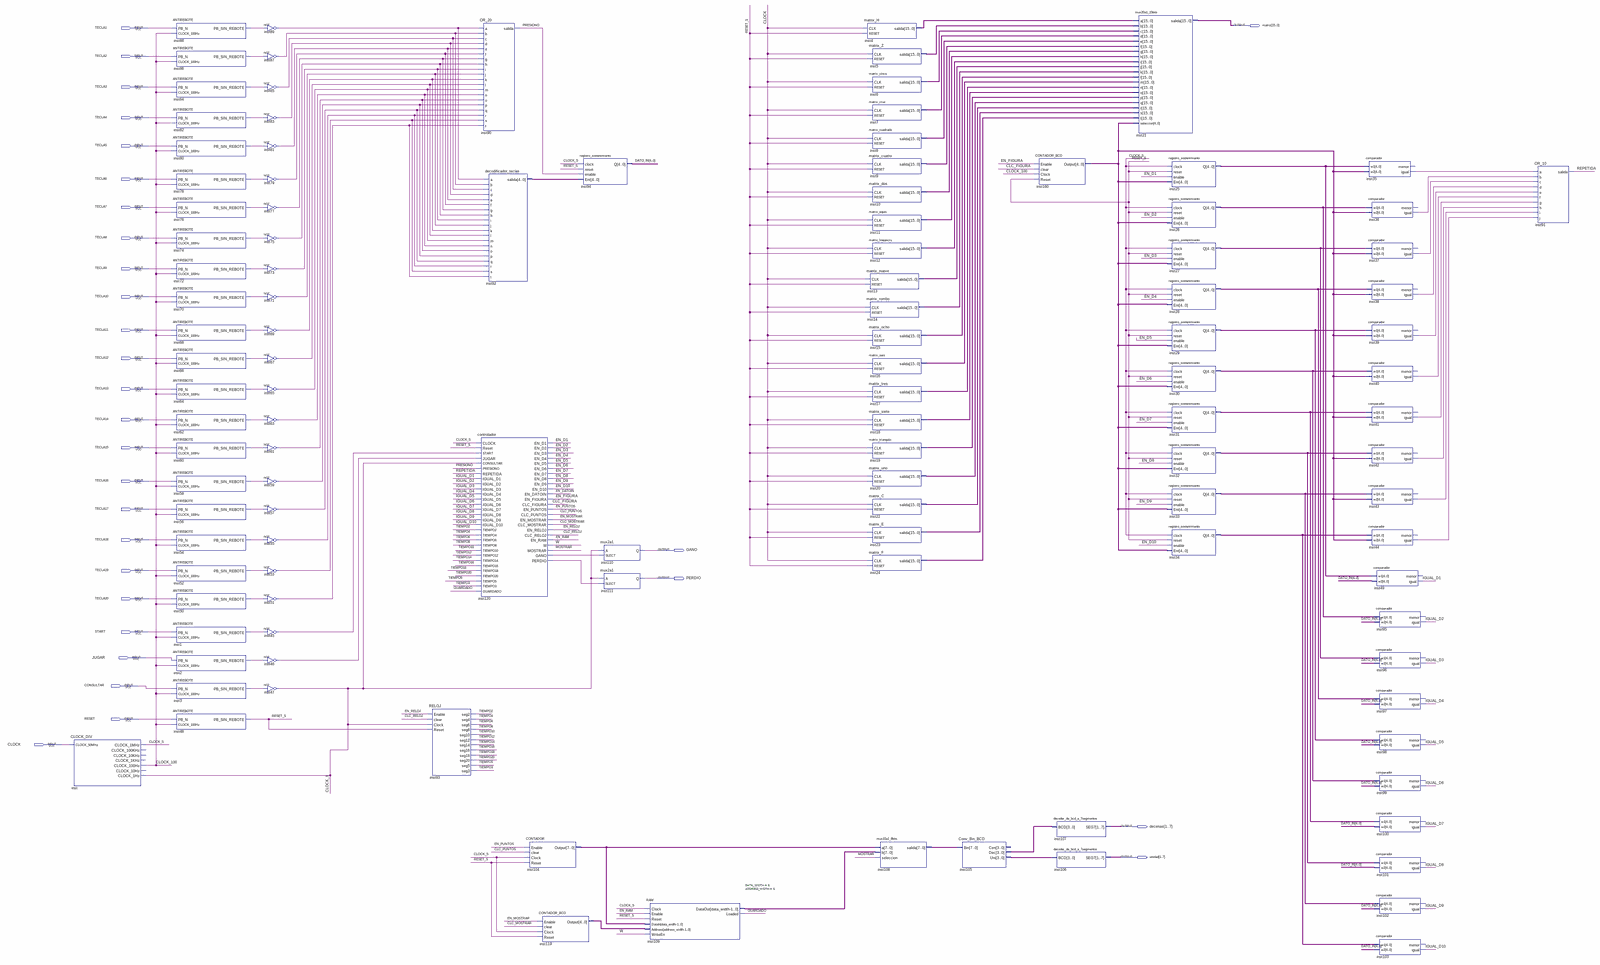
[diagram p0: schematic sheet, whole]
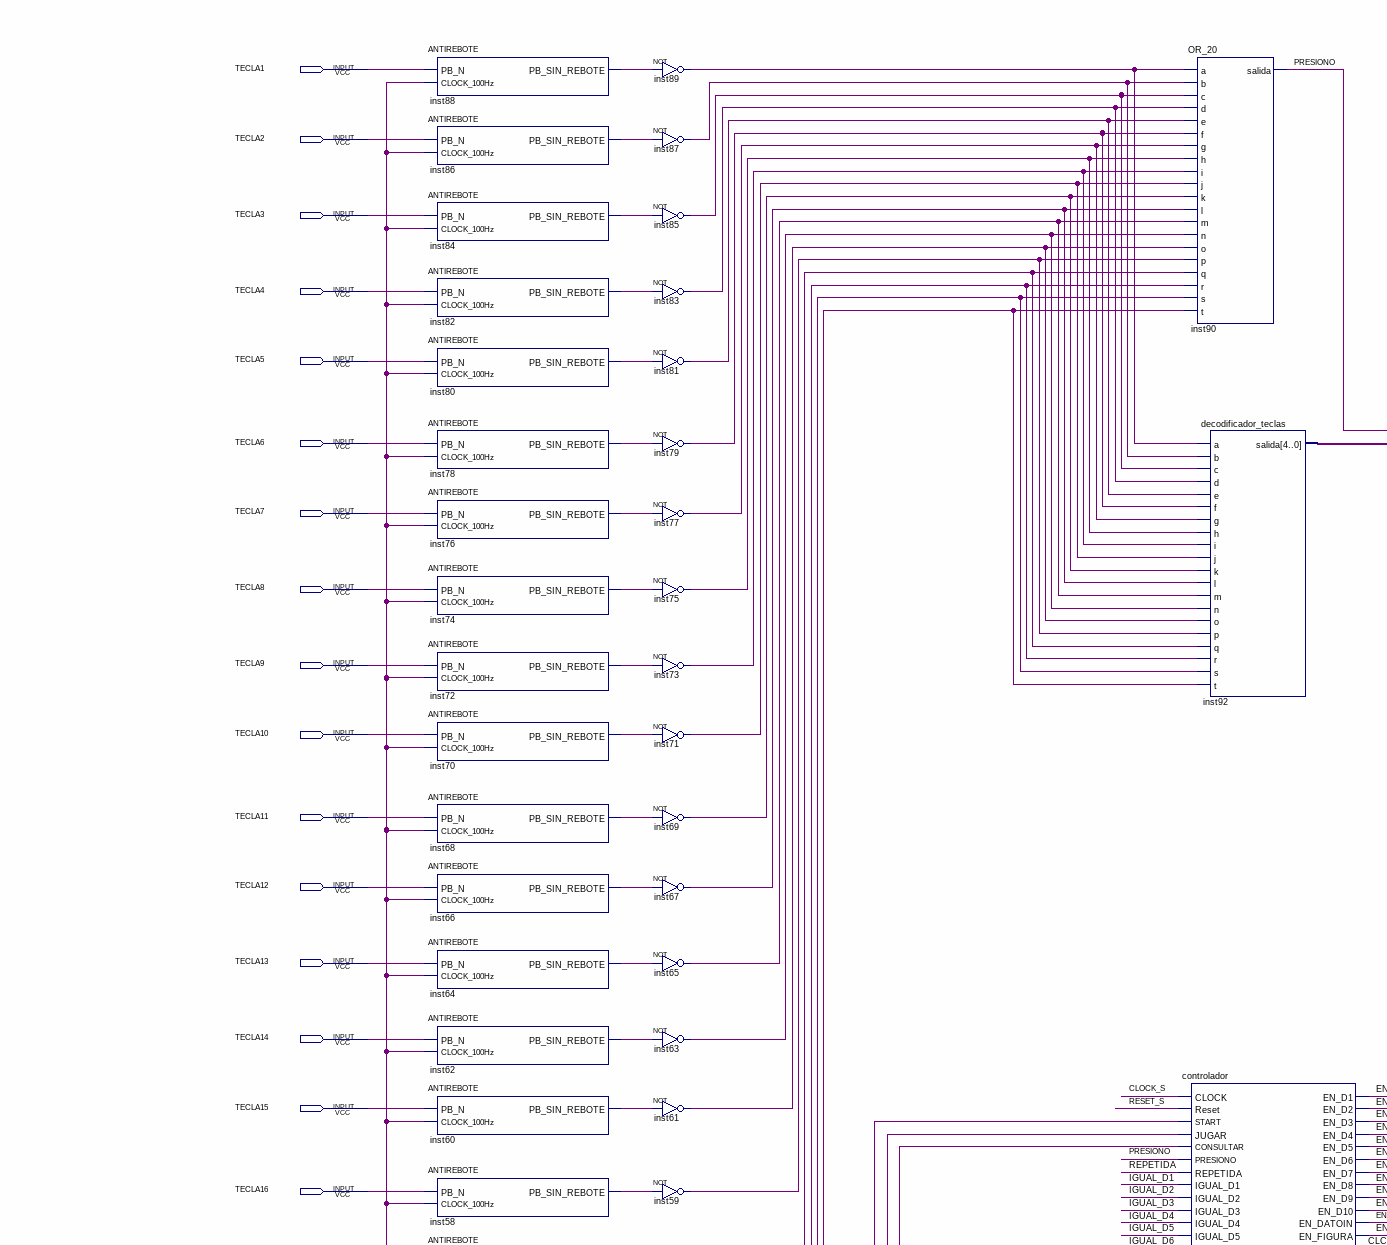
[diagram p1: schematic sheet, upper left part]
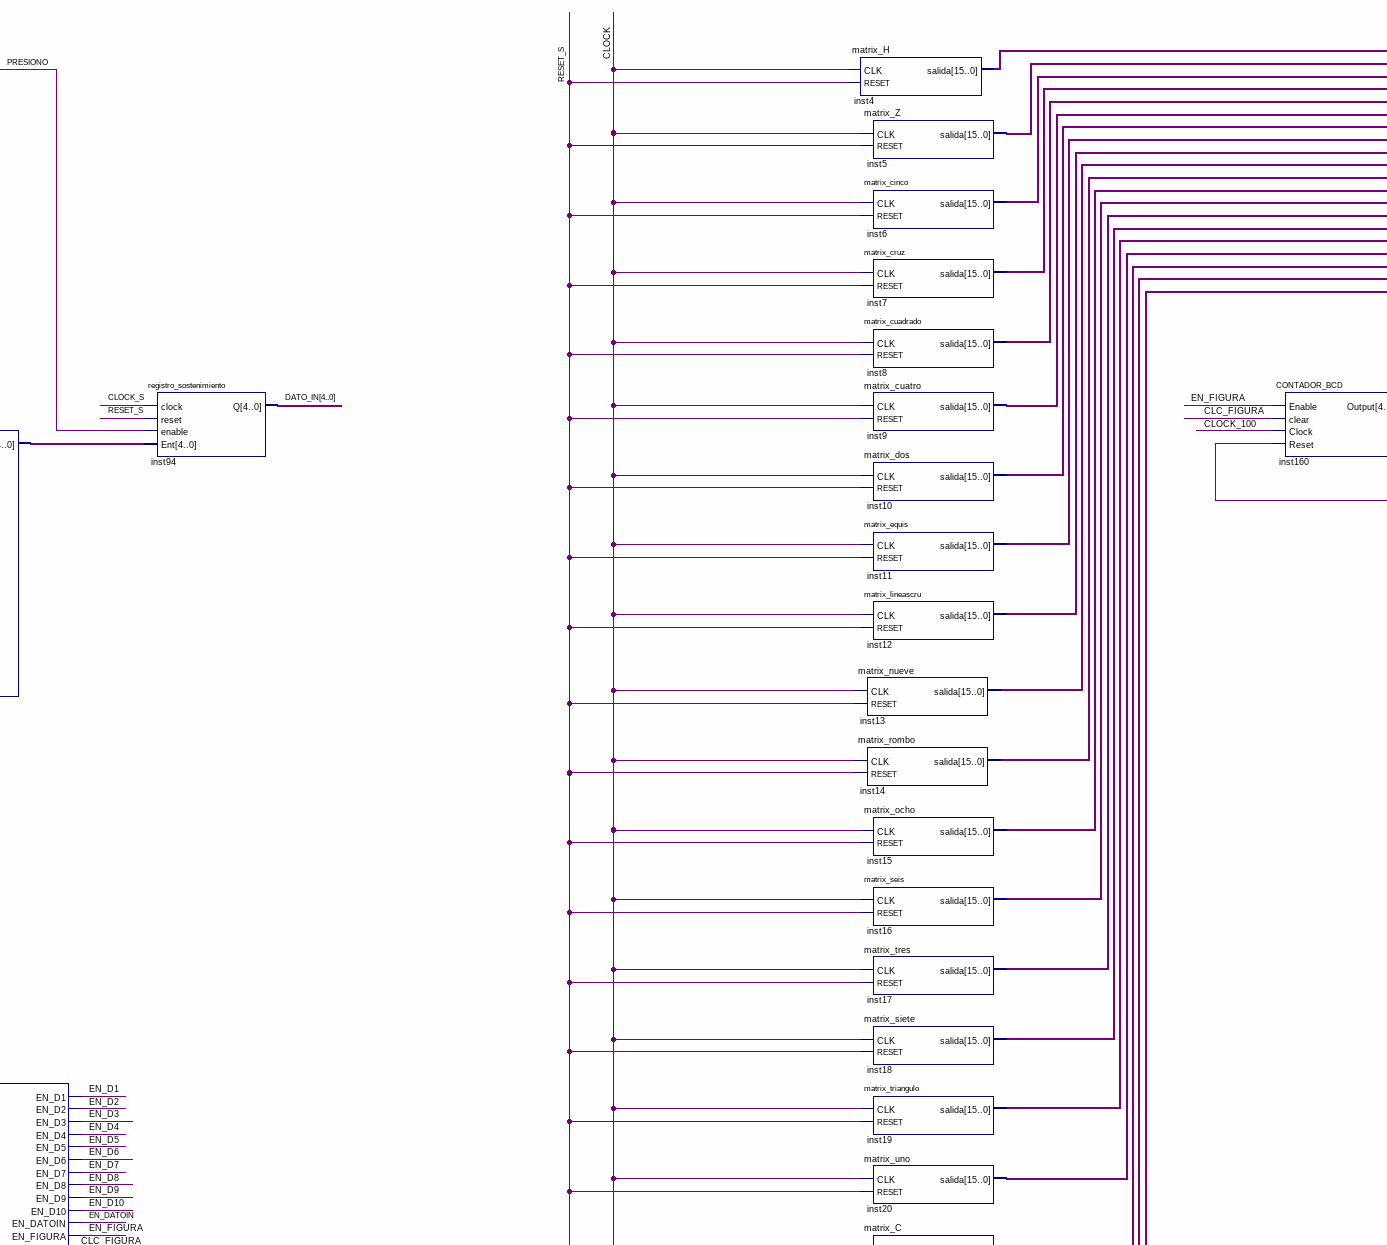
[diagram p2: schematic sheet, upper centre part]
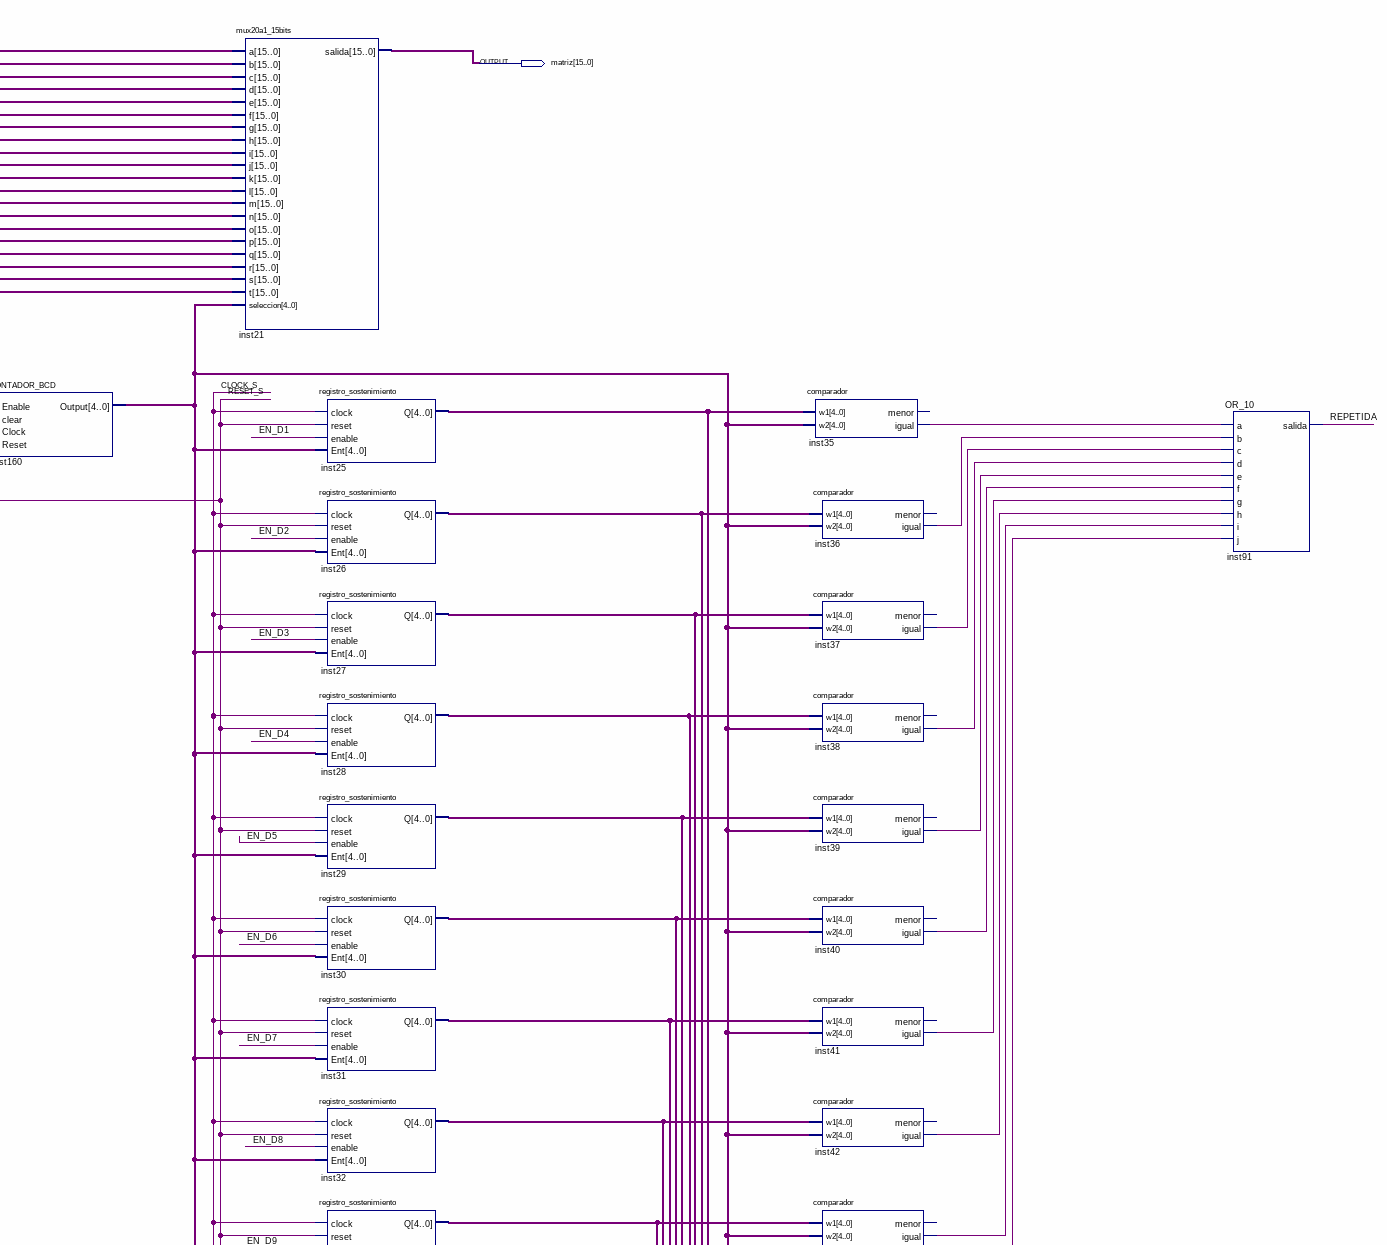
[diagram p3: schematic sheet, upper right part]
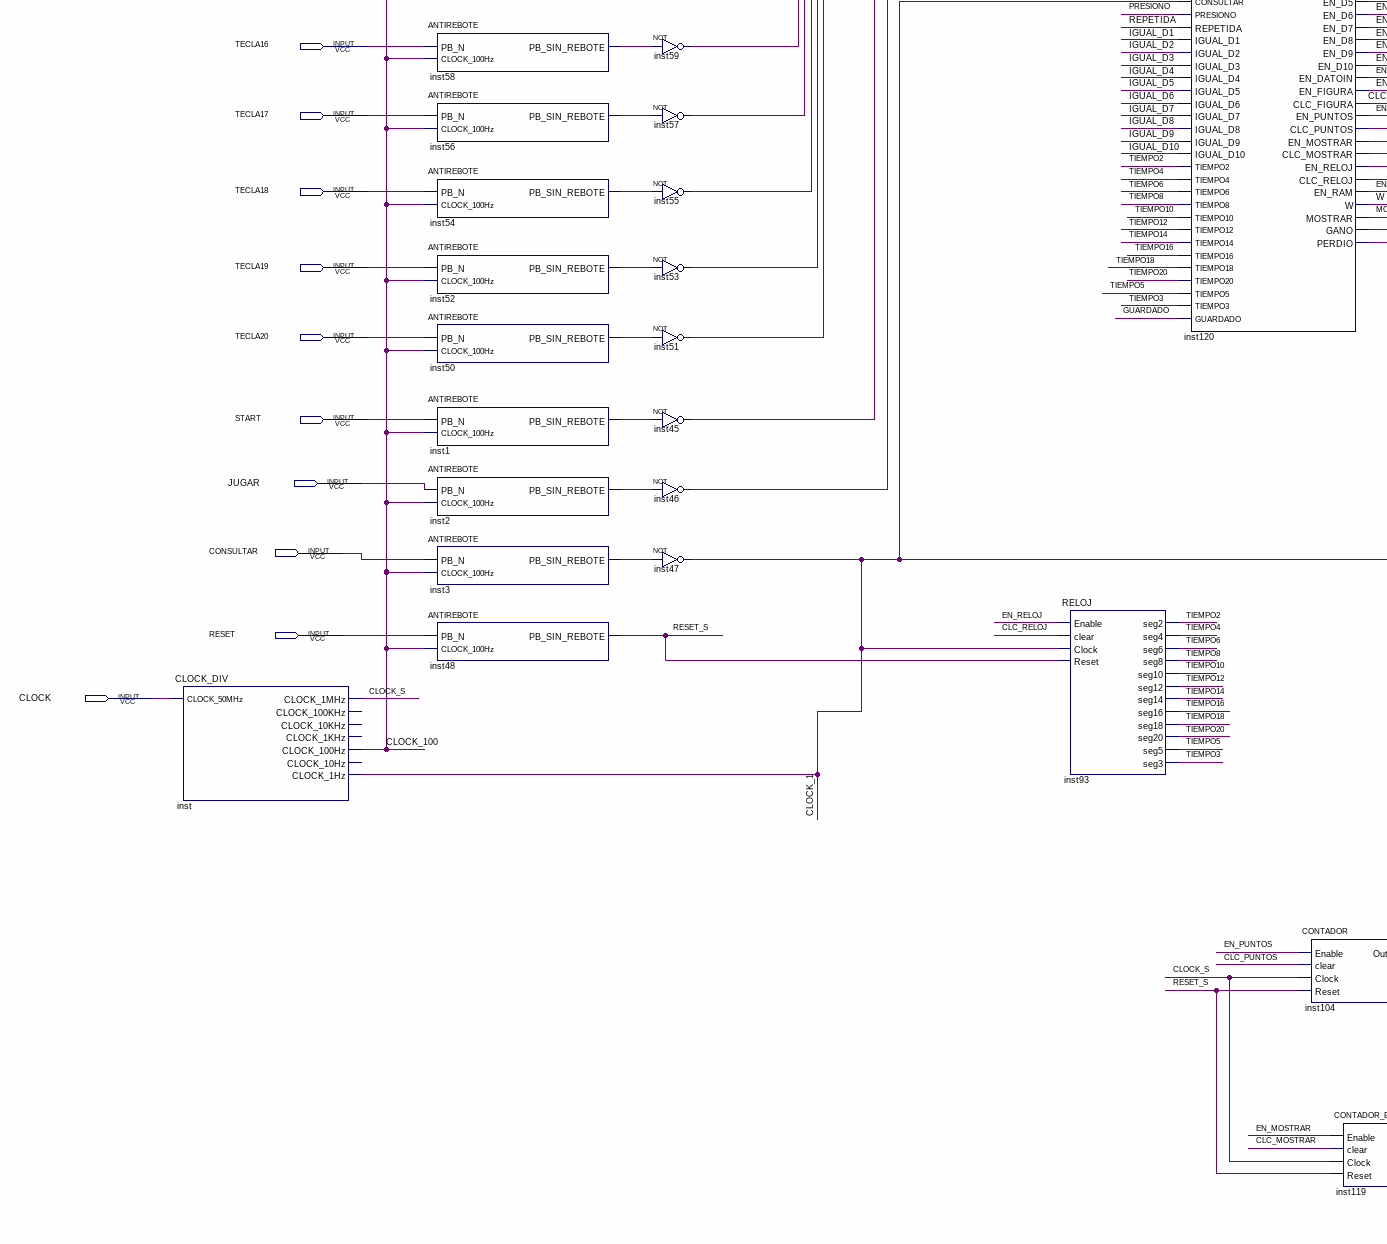
[diagram p4: schematic sheet, lower left part]
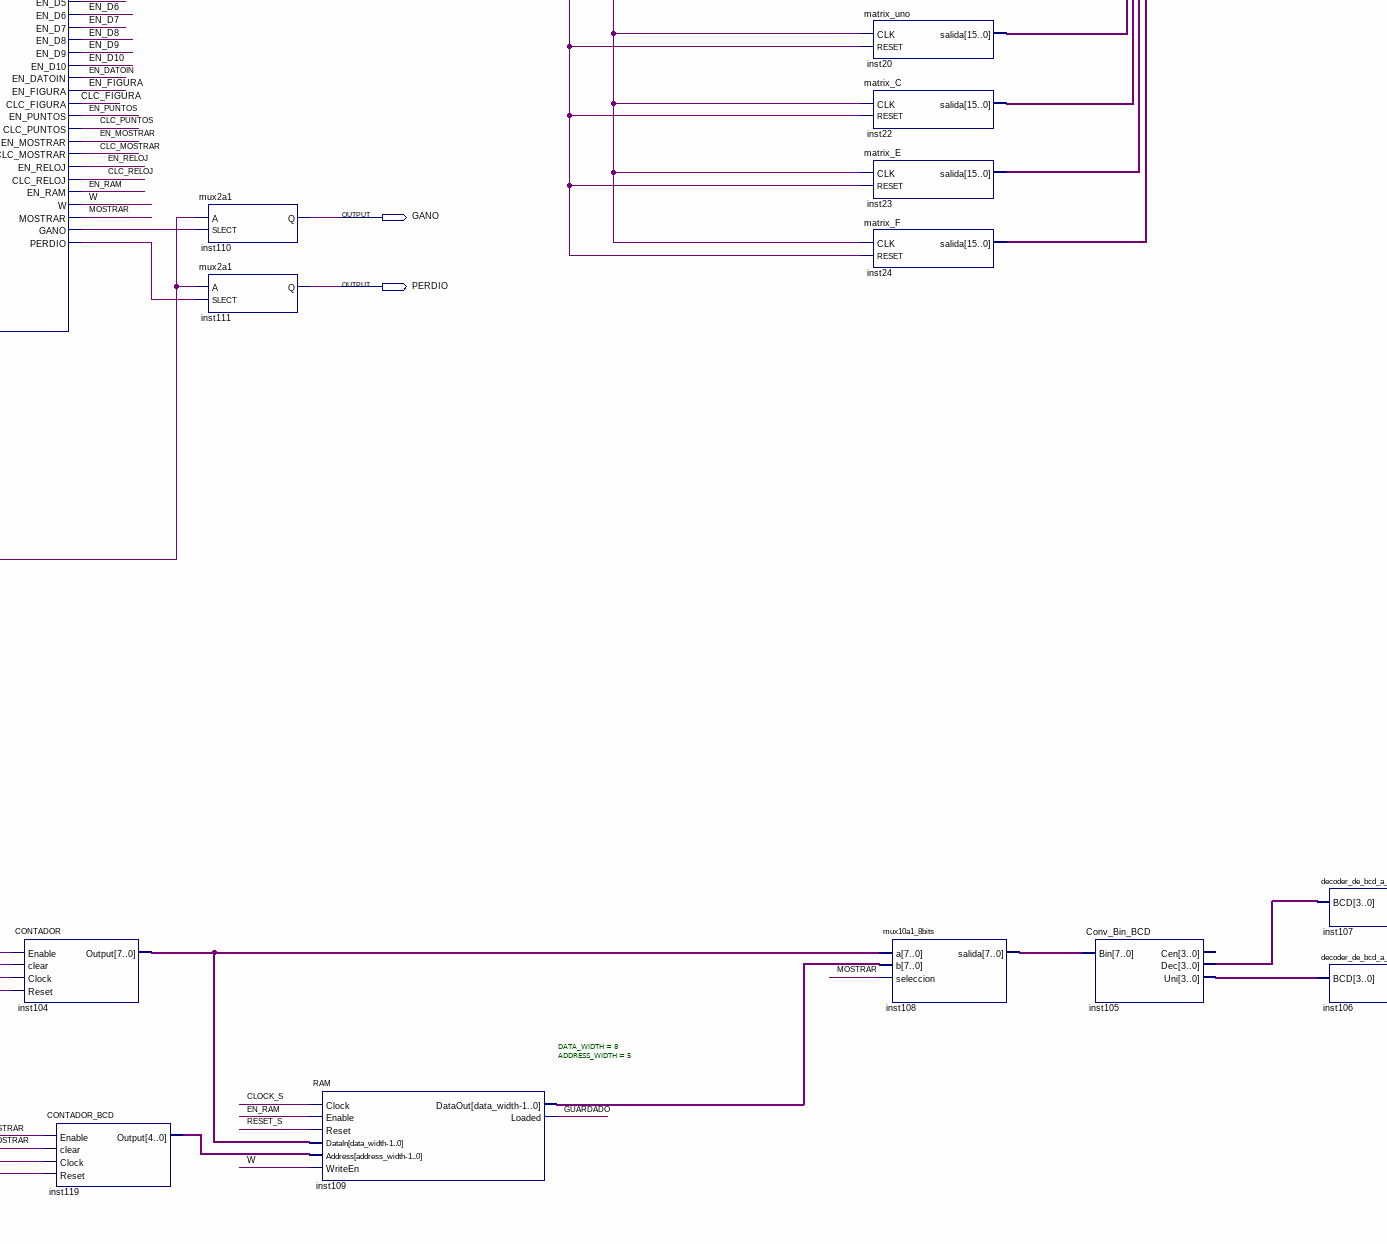
[diagram p5: schematic sheet, lower centre part]
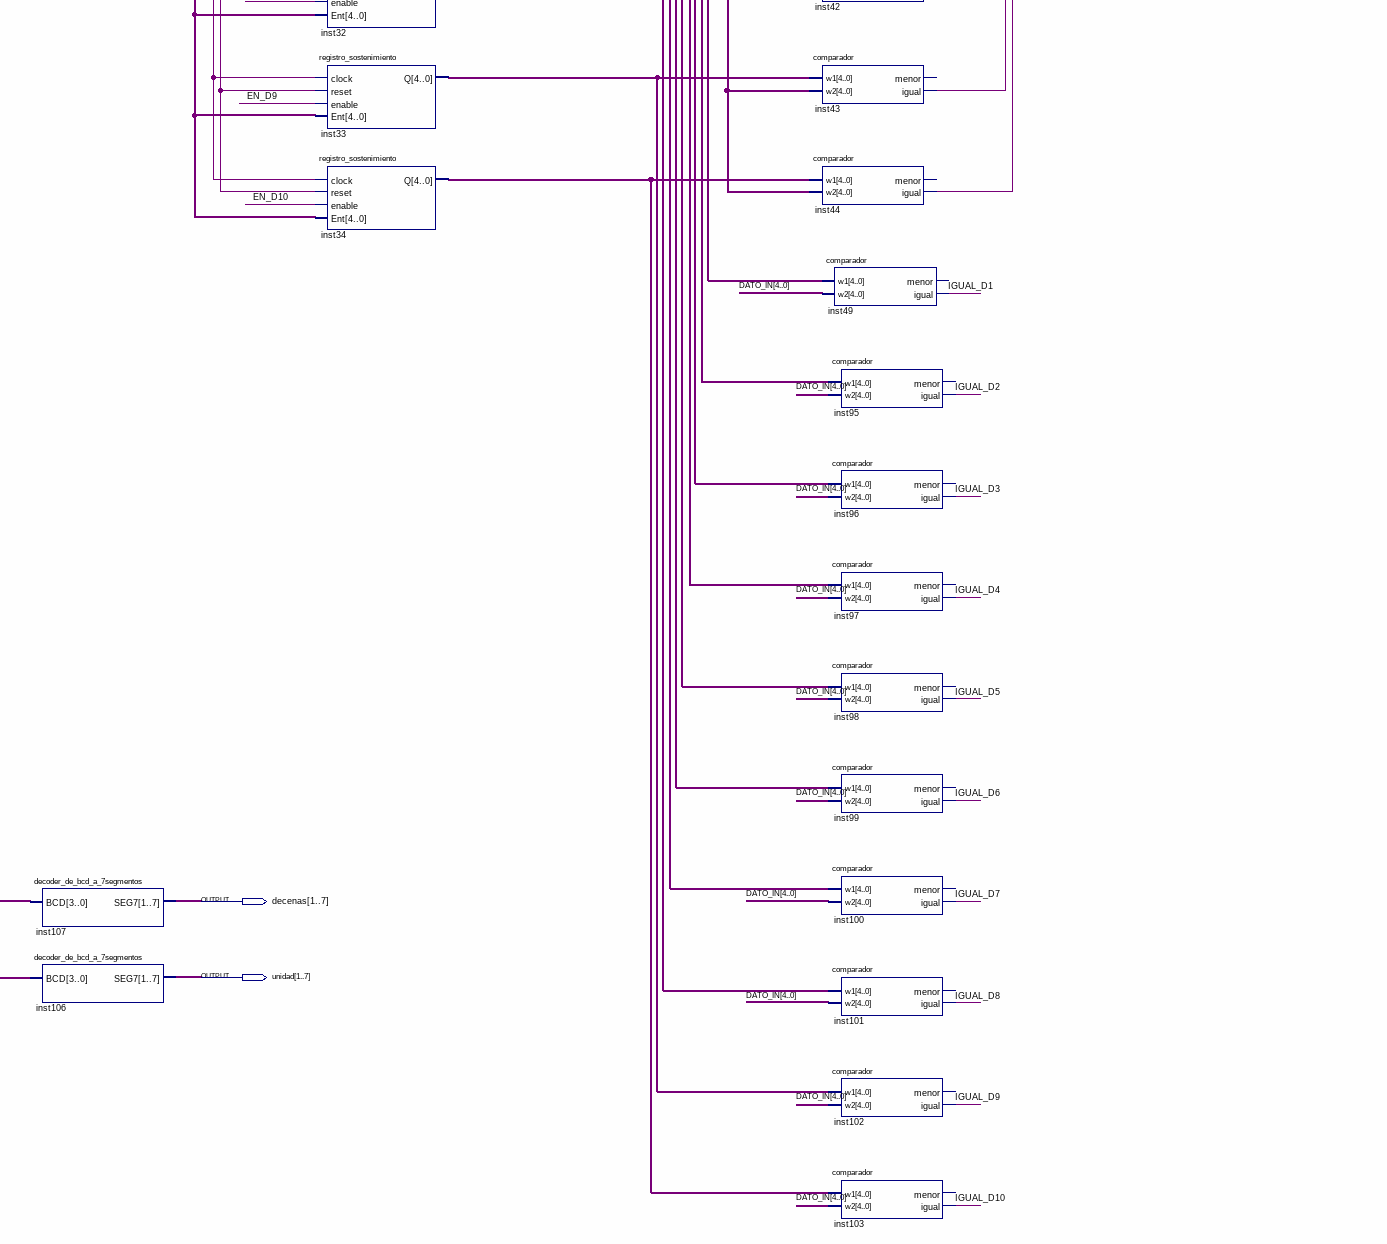
[diagram p6: schematic sheet, lower right part]
// Quartus schematic juego_de_memoria.bdf as structural Verilog: 115 symbols, 30 pins
module juego_de_memoria (
  input  TECLA1,
  input  TECLA2,
  input  TECLA3,
  input  TECLA4,
  input  TECLA5,
  input  TECLA6,
  input  TECLA7,
  input  TECLA8,
  input  TECLA9,
  input  TECLA10,
  input  TECLA11,
  input  TECLA12,
  input  TECLA13,
  input  TECLA14,
  input  TECLA15,
  input  TECLA16,
  input  TECLA17,
  input  TECLA18,
  input  TECLA19,
  input  TECLA20,
  input  START,
  input  JUGAR,
  input  CONSULTAR,
  input  RESET,
  input  CLOCK,
  output [15:0] matriz,
  output GANO,
  output PERDIO,
  output [1:7] decenas,
  output [1:7] unidad
);

  wire CLC_FIGURA, CLC_MOSTRAR, CLC_PUNTOS, CLC_RELOJ, CLOCK_1, CLOCK_100, CLOCK_S, EN_D1, EN_D2, EN_D3,
       EN_D4, EN_D5, EN_D6, EN_D7, EN_D8, EN_D9, EN_D10, EN_DATOIN, EN_FIGURA, EN_MOSTRAR, EN_PUNTOS, EN_RAM,
       EN_RELOJ, GUARDADO, IGUAL_D1, IGUAL_D2, IGUAL_D3, IGUAL_D4, IGUAL_D5, IGUAL_D6, IGUAL_D7, IGUAL_D8,
       IGUAL_D9, IGUAL_D10, inst1_pb_sin_rebote, inst2_pb_sin_rebote, inst3_pb_sin_rebote, inst35_igual,
       inst36_igual, inst37_igual, inst38_igual, inst39_igual, inst40_igual, inst41_igual, inst42_igual,
       inst43_igual, inst44_igual, inst45_out, inst46_out, inst50_pb_sin_rebote, inst51_out,
       inst52_pb_sin_rebote, inst53_out, inst54_pb_sin_rebote, inst55_out, inst56_pb_sin_rebote, inst57_out,
       inst58_pb_sin_rebote, inst59_out, inst60_pb_sin_rebote, inst61_out, inst62_pb_sin_rebote, inst63_out,
       inst64_pb_sin_rebote, inst65_out, inst66_pb_sin_rebote, inst67_out, inst68_pb_sin_rebote, inst69_out,
       inst70_pb_sin_rebote, inst71_out, inst72_pb_sin_rebote, inst73_out, inst74_pb_sin_rebote, inst75_out,
       inst76_pb_sin_rebote, inst77_out, inst78_pb_sin_rebote, inst79_out, inst80_pb_sin_rebote, inst81_out,
       inst82_pb_sin_rebote, inst83_out, inst84_pb_sin_rebote, inst85_out, inst86_pb_sin_rebote, inst87_out,
       inst88_pb_sin_rebote, inst89_out, inst120_gano, inst120_perdio, MOSTRAR, PRESIONO, REPETIDA, RESET_S,
       TIEMPO2, TIEMPO3, TIEMPO4, TIEMPO5, TIEMPO6, TIEMPO8, TIEMPO10, TIEMPO12, TIEMPO14, TIEMPO16,
       TIEMPO18, TIEMPO20, W;
  wire [3:0] inst105_dec, inst105_uni;
  wire [4:0] DATO_IN, inst25_q, inst26_q, inst27_q, inst28_q, inst29_q, inst30_q, inst31_q, inst32_q,
       inst33_q, inst34_q, inst92_salida, inst119_output, inst160_output;
  wire [7:0] inst104_output, inst108_salida, inst109_dataout;
  wire [15:0] inst4_salida, inst5_salida, inst6_salida, inst7_salida, inst8_salida, inst9_salida,
       inst10_salida, inst11_salida, inst12_salida, inst13_salida, inst14_salida, inst15_salida,
       inst16_salida, inst17_salida, inst18_salida, inst19_salida, inst20_salida, inst22_salida,
       inst23_salida, inst24_salida;

  CLOCK_DIV inst (
    .CLOCK_50MHz(CLOCK), .CLOCK_1MHz(CLOCK_S), .CLOCK_100Hz(CLOCK_100), .CLOCK_1Hz(CLOCK_1));  // open: CLOCK_100KHz, CLOCK_10KHz, CLOCK_1KHz, CLOCK_10Hz
  ANTIREBOTE inst88 (.PB_N(TECLA1), .CLOCK_100Hz(CLOCK_100), .PB_SIN_REBOTE(inst88_pb_sin_rebote));
  ANTIREBOTE inst86 (.PB_N(TECLA2), .CLOCK_100Hz(CLOCK_100), .PB_SIN_REBOTE(inst86_pb_sin_rebote));
  ANTIREBOTE inst84 (.PB_N(TECLA3), .CLOCK_100Hz(CLOCK_100), .PB_SIN_REBOTE(inst84_pb_sin_rebote));
  ANTIREBOTE inst82 (.PB_N(TECLA4), .CLOCK_100Hz(CLOCK_100), .PB_SIN_REBOTE(inst82_pb_sin_rebote));
  ANTIREBOTE inst80 (.PB_N(TECLA5), .CLOCK_100Hz(CLOCK_100), .PB_SIN_REBOTE(inst80_pb_sin_rebote));
  ANTIREBOTE inst78 (.PB_N(TECLA6), .CLOCK_100Hz(CLOCK_100), .PB_SIN_REBOTE(inst78_pb_sin_rebote));
  ANTIREBOTE inst76 (.PB_N(TECLA7), .CLOCK_100Hz(CLOCK_100), .PB_SIN_REBOTE(inst76_pb_sin_rebote));
  ANTIREBOTE inst74 (.PB_N(TECLA8), .CLOCK_100Hz(CLOCK_100), .PB_SIN_REBOTE(inst74_pb_sin_rebote));
  ANTIREBOTE inst72 (.PB_N(TECLA9), .CLOCK_100Hz(CLOCK_100), .PB_SIN_REBOTE(inst72_pb_sin_rebote));
  ANTIREBOTE inst70 (.PB_N(TECLA10), .CLOCK_100Hz(CLOCK_100), .PB_SIN_REBOTE(inst70_pb_sin_rebote));
  ANTIREBOTE inst68 (.PB_N(TECLA11), .CLOCK_100Hz(CLOCK_100), .PB_SIN_REBOTE(inst68_pb_sin_rebote));
  ANTIREBOTE inst66 (.PB_N(TECLA12), .CLOCK_100Hz(CLOCK_100), .PB_SIN_REBOTE(inst66_pb_sin_rebote));
  ANTIREBOTE inst64 (.PB_N(TECLA13), .CLOCK_100Hz(CLOCK_100), .PB_SIN_REBOTE(inst64_pb_sin_rebote));
  ANTIREBOTE inst62 (.PB_N(TECLA14), .CLOCK_100Hz(CLOCK_100), .PB_SIN_REBOTE(inst62_pb_sin_rebote));
  ANTIREBOTE inst60 (.PB_N(TECLA15), .CLOCK_100Hz(CLOCK_100), .PB_SIN_REBOTE(inst60_pb_sin_rebote));
  ANTIREBOTE inst58 (.PB_N(TECLA16), .CLOCK_100Hz(CLOCK_100), .PB_SIN_REBOTE(inst58_pb_sin_rebote));
  ANTIREBOTE inst56 (.PB_N(TECLA17), .CLOCK_100Hz(CLOCK_100), .PB_SIN_REBOTE(inst56_pb_sin_rebote));
  ANTIREBOTE inst54 (.PB_N(TECLA18), .CLOCK_100Hz(CLOCK_100), .PB_SIN_REBOTE(inst54_pb_sin_rebote));
  ANTIREBOTE inst52 (.PB_N(TECLA19), .CLOCK_100Hz(CLOCK_100), .PB_SIN_REBOTE(inst52_pb_sin_rebote));
  ANTIREBOTE inst50 (.PB_N(TECLA20), .CLOCK_100Hz(CLOCK_100), .PB_SIN_REBOTE(inst50_pb_sin_rebote));
  ANTIREBOTE inst1 (.PB_N(START), .CLOCK_100Hz(CLOCK_100), .PB_SIN_REBOTE(inst1_pb_sin_rebote));
  ANTIREBOTE inst2 (.PB_N(JUGAR), .CLOCK_100Hz(CLOCK_100), .PB_SIN_REBOTE(inst2_pb_sin_rebote));
  ANTIREBOTE inst3 (.PB_N(CONSULTAR), .CLOCK_100Hz(CLOCK_100), .PB_SIN_REBOTE(inst3_pb_sin_rebote));
  ANTIREBOTE inst48 (.PB_N(RESET), .CLOCK_100Hz(CLOCK_100), .PB_SIN_REBOTE(RESET_S));
  not inst89 (inst89_out, inst88_pb_sin_rebote);
  not inst87 (inst87_out, inst86_pb_sin_rebote);
  not inst85 (inst85_out, inst84_pb_sin_rebote);
  not inst83 (inst83_out, inst82_pb_sin_rebote);
  not inst81 (inst81_out, inst80_pb_sin_rebote);
  not inst79 (inst79_out, inst78_pb_sin_rebote);
  not inst77 (inst77_out, inst76_pb_sin_rebote);
  not inst75 (inst75_out, inst74_pb_sin_rebote);
  not inst73 (inst73_out, inst72_pb_sin_rebote);
  not inst71 (inst71_out, inst70_pb_sin_rebote);
  not inst69 (inst69_out, inst68_pb_sin_rebote);
  not inst67 (inst67_out, inst66_pb_sin_rebote);
  not inst65 (inst65_out, inst64_pb_sin_rebote);
  not inst63 (inst63_out, inst62_pb_sin_rebote);
  not inst61 (inst61_out, inst60_pb_sin_rebote);
  not inst59 (inst59_out, inst58_pb_sin_rebote);
  not inst57 (inst57_out, inst56_pb_sin_rebote);
  not inst55 (inst55_out, inst54_pb_sin_rebote);
  not inst53 (inst53_out, inst52_pb_sin_rebote);
  not inst51 (inst51_out, inst50_pb_sin_rebote);
  not inst45 (inst45_out, inst1_pb_sin_rebote);
  not inst46 (inst46_out, inst2_pb_sin_rebote);
  not inst47 (CLOCK_1, inst3_pb_sin_rebote);
  RELOJ inst93 (
    .Enable(EN_RELOJ), .clear(CLC_RELOJ), .Clock(CLOCK_1), .Reset(RESET_S), .seg2(TIEMPO2), .seg4(TIEMPO4),
    .seg6(TIEMPO6), .seg8(TIEMPO8), .seg10(TIEMPO10), .seg12(TIEMPO12), .seg14(TIEMPO14), .seg16(TIEMPO16),
    .seg18(TIEMPO18), .seg20(TIEMPO20), .seg5(TIEMPO5), .seg3(TIEMPO3));
  OR_20 inst90 (
    .a(inst89_out), .b(inst87_out), .c(inst85_out), .d(inst83_out), .e(inst81_out), .f(inst79_out),
    .g(inst77_out), .h(inst75_out), .i(inst73_out), .j(inst71_out), .k(inst69_out), .l(inst67_out),
    .m(inst65_out), .n(inst63_out), .o(inst61_out), .p(inst59_out), .q(inst57_out), .r(inst55_out),
    .s(inst53_out), .t(inst51_out), .salida(PRESIONO));
  decodificador_teclas inst92 (
    .a(inst89_out), .b(inst87_out), .c(inst85_out), .d(inst83_out), .e(inst81_out), .f(inst79_out),
    .g(inst77_out), .h(inst75_out), .i(inst73_out), .j(inst71_out), .k(inst69_out), .l(inst67_out),
    .m(inst65_out), .n(inst63_out), .o(inst61_out), .p(inst59_out), .q(inst57_out), .r(inst55_out),
    .s(inst53_out), .t(inst51_out), .salida(inst92_salida));
  controlador inst120 (
    .CLOCK(CLOCK_S), .Reset(RESET_S), .START(inst45_out), .JUGAR(inst46_out), .CONSULTAR(CLOCK_1),
    .PRESIONO(PRESIONO), .REPETIDA(REPETIDA), .IGUAL_D1(IGUAL_D1), .IGUAL_D2(IGUAL_D2), .IGUAL_D3(IGUAL_D3),
    .IGUAL_D4(IGUAL_D4), .IGUAL_D5(IGUAL_D5), .IGUAL_D6(IGUAL_D6), .IGUAL_D7(IGUAL_D7), .IGUAL_D8(IGUAL_D8),
    .IGUAL_D9(IGUAL_D9), .IGUAL_D10(IGUAL_D10), .TIEMPO2(TIEMPO2), .TIEMPO4(TIEMPO4), .TIEMPO6(TIEMPO6),
    .TIEMPO8(TIEMPO8), .TIEMPO10(TIEMPO10), .TIEMPO12(TIEMPO12), .TIEMPO14(TIEMPO14), .TIEMPO16(TIEMPO16),
    .TIEMPO18(TIEMPO18), .TIEMPO20(TIEMPO20), .TIEMPO5(TIEMPO5), .TIEMPO3(TIEMPO3), .GUARDADO(GUARDADO),
    .EN_D1(EN_D1), .EN_D2(EN_D2), .EN_D3(EN_D3), .EN_D4(EN_D4), .EN_D5(EN_D5), .EN_D6(EN_D6), .EN_D7(EN_D7),
    .EN_D8(EN_D8), .EN_D9(EN_D9), .EN_D10(EN_D10), .EN_DATOIN(EN_DATOIN), .EN_FIGURA(EN_FIGURA),
    .CLC_FIGURA(CLC_FIGURA), .EN_PUNTOS(EN_PUNTOS), .CLC_PUNTOS(CLC_PUNTOS), .EN_MOSTRAR(EN_MOSTRAR),
    .CLC_MOSTRAR(CLC_MOSTRAR), .EN_RELOJ(EN_RELOJ), .CLC_RELOJ(CLC_RELOJ), .EN_RAM(EN_RAM), .W(W),
    .MOSTRAR(MOSTRAR), .GANO(inst120_gano), .PERDIO(inst120_perdio));
  CONTADOR inst104 (.Enable(EN_PUNTOS), .clear(CLC_PUNTOS), .Clock(CLOCK_S), .Reset(RESET_S), .Output(inst104_output));
  CONTADOR_BCD inst119 (
    .Enable(EN_MOSTRAR), .clear(CLC_MOSTRAR), .Clock(CLOCK_S), .Reset(RESET_S), .Output(inst119_output));
  registro_sostenimiento inst94 (.clock(CLOCK_S), .reset(RESET_S), .enable(PRESIONO), .Ent(inst92_salida), .Q(DATO_IN));
  mux2a1 inst110 (.A(CLOCK_1), .SLECT(inst120_gano), .Q(GANO));
  mux2a1 inst111 (.A(CLOCK_1), .SLECT(inst120_perdio), .Q(PERDIO));
  RAM #(.DATA_WIDTH(8), .ADDRESS_WIDTH(5)) inst109 (
    .Clock(CLOCK_S), .Enable(EN_RAM), .Reset(RESET_S), .DataIn(inst104_output), .Address(inst119_output),
    .WriteEn(W), .DataOut(inst109_dataout), .Loaded(GUARDADO));
  matrix_H inst4 (.CLK(CLOCK), .RESET(RESET_S), .salida(inst4_salida));
  matrix_Z inst5 (.CLK(CLOCK), .RESET(RESET_S), .salida(inst5_salida));
  matrix_cinco inst6 (.CLK(CLOCK), .RESET(RESET_S), .salida(inst6_salida));
  matrix_cruz inst7 (.CLK(CLOCK), .RESET(RESET_S), .salida(inst7_salida));
  matrix_cuadrado inst8 (.CLK(CLOCK), .RESET(RESET_S), .salida(inst8_salida));
  matrix_cuatro inst9 (.CLK(CLOCK), .RESET(RESET_S), .salida(inst9_salida));
  matrix_dos inst10 (.CLK(CLOCK), .RESET(RESET_S), .salida(inst10_salida));
  matrix_equis inst11 (.CLK(CLOCK), .RESET(RESET_S), .salida(inst11_salida));
  matrix_lineascru inst12 (.CLK(CLOCK), .RESET(RESET_S), .salida(inst12_salida));
  matrix_nueve inst13 (.CLK(CLOCK), .RESET(RESET_S), .salida(inst13_salida));
  matrix_rombo inst14 (.CLK(CLOCK), .RESET(RESET_S), .salida(inst14_salida));
  matrix_ocho inst15 (.CLK(CLOCK), .RESET(RESET_S), .salida(inst15_salida));
  matrix_seis inst16 (.CLK(CLOCK), .RESET(RESET_S), .salida(inst16_salida));
  matrix_tres inst17 (.CLK(CLOCK), .RESET(RESET_S), .salida(inst17_salida));
  matrix_siete inst18 (.CLK(CLOCK), .RESET(RESET_S), .salida(inst18_salida));
  matrix_triangulo inst19 (.CLK(CLOCK), .RESET(RESET_S), .salida(inst19_salida));
  matrix_uno inst20 (.CLK(CLOCK), .RESET(RESET_S), .salida(inst20_salida));
  matrix_C inst22 (.CLK(CLOCK), .RESET(RESET_S), .salida(inst22_salida));
  matrix_E inst23 (.CLK(CLOCK), .RESET(RESET_S), .salida(inst23_salida));
  matrix_F inst24 (.CLK(CLOCK), .RESET(RESET_S), .salida(inst24_salida));
  mux10a1_8bits inst108 (.a(inst104_output), .b(inst109_dataout), .seleccion(MOSTRAR), .salida(inst108_salida));
  Conv_Bin_BCD inst105 (.Bin(inst108_salida), .Dec(inst105_dec), .Uni(inst105_uni));  // open: Cen
  CONTADOR_BCD inst160 (
    .Enable(EN_FIGURA), .clear(CLC_FIGURA), .Clock(CLOCK_100), .Reset(RESET_S), .Output(inst160_output));
  decoder_de_bcd_a_7segmentos inst107 (.BCD(inst105_dec), .SEG7(decenas));
  decoder_de_bcd_a_7segmentos inst106 (.BCD(inst105_uni), .SEG7(unidad));
  mux20a1_15bits inst21 (
    .a(inst4_salida), .b(inst5_salida), .c(inst6_salida), .d(inst7_salida), .e(inst8_salida),
    .f(inst9_salida), .g(inst10_salida), .h(inst11_salida), .i(inst12_salida), .j(inst13_salida),
    .k(inst14_salida), .l(inst15_salida), .m(inst16_salida), .n(inst17_salida), .o(inst18_salida),
    .p(inst19_salida), .q(inst20_salida), .r(inst22_salida), .s(inst23_salida), .t(inst24_salida),
    .seleccion(inst160_output), .salida(matriz));
  registro_sostenimiento inst25 (.clock(CLOCK_S), .reset(RESET_S), .enable(EN_D1), .Ent(inst160_output), .Q(inst25_q));
  registro_sostenimiento inst26 (.clock(CLOCK_S), .reset(RESET_S), .enable(EN_D2), .Ent(inst160_output), .Q(inst26_q));
  registro_sostenimiento inst27 (.clock(CLOCK_S), .reset(RESET_S), .enable(EN_D3), .Ent(inst160_output), .Q(inst27_q));
  registro_sostenimiento inst28 (.clock(CLOCK_S), .reset(RESET_S), .enable(EN_D4), .Ent(inst160_output), .Q(inst28_q));
  registro_sostenimiento inst29 (.clock(CLOCK_S), .reset(RESET_S), .enable(EN_D5), .Ent(inst160_output), .Q(inst29_q));
  registro_sostenimiento inst30 (.clock(CLOCK_S), .reset(RESET_S), .enable(EN_D6), .Ent(inst160_output), .Q(inst30_q));
  registro_sostenimiento inst31 (.clock(CLOCK_S), .reset(RESET_S), .enable(EN_D7), .Ent(inst160_output), .Q(inst31_q));
  registro_sostenimiento inst32 (.clock(CLOCK_S), .reset(RESET_S), .enable(EN_D8), .Ent(inst160_output), .Q(inst32_q));
  registro_sostenimiento inst33 (.clock(CLOCK_S), .reset(RESET_S), .enable(EN_D9), .Ent(inst160_output), .Q(inst33_q));
  registro_sostenimiento inst34 (.clock(CLOCK_S), .reset(RESET_S), .enable(EN_D10), .Ent(inst160_output), .Q(inst34_q));
  comparador inst35 (.w1(inst25_q), .w2(inst160_output), .igual(inst35_igual));  // open: menor
  comparador inst36 (.w1(inst26_q), .w2(inst160_output), .igual(inst36_igual));  // open: menor
  comparador inst37 (.w1(inst27_q), .w2(inst160_output), .igual(inst37_igual));  // open: menor
  comparador inst38 (.w1(inst28_q), .w2(inst160_output), .igual(inst38_igual));  // open: menor
  comparador inst39 (.w1(inst29_q), .w2(inst160_output), .igual(inst39_igual));  // open: menor
  comparador inst40 (.w1(inst30_q), .w2(inst160_output), .igual(inst40_igual));  // open: menor
  comparador inst41 (.w1(inst31_q), .w2(inst160_output), .igual(inst41_igual));  // open: menor
  comparador inst42 (.w1(inst32_q), .w2(inst160_output), .igual(inst42_igual));  // open: menor
  comparador inst43 (.w1(inst33_q), .w2(inst160_output), .igual(inst43_igual));  // open: menor
  comparador inst44 (.w1(inst34_q), .w2(inst160_output), .igual(inst44_igual));  // open: menor
  comparador inst49 (.w1(inst25_q), .w2(DATO_IN), .igual(IGUAL_D1));  // open: menor
  comparador inst95 (.w1(inst26_q), .w2(DATO_IN), .igual(IGUAL_D2));  // open: menor
  comparador inst96 (.w1(inst27_q), .w2(DATO_IN), .igual(IGUAL_D3));  // open: menor
  comparador inst97 (.w1(inst28_q), .w2(DATO_IN), .igual(IGUAL_D4));  // open: menor
  comparador inst98 (.w1(inst29_q), .w2(DATO_IN), .igual(IGUAL_D5));  // open: menor
  comparador inst99 (.w1(inst30_q), .w2(DATO_IN), .igual(IGUAL_D6));  // open: menor
  comparador inst100 (.w1(inst31_q), .w2(DATO_IN), .igual(IGUAL_D7));  // open: menor
  comparador inst101 (.w1(inst32_q), .w2(DATO_IN), .igual(IGUAL_D8));  // open: menor
  comparador inst102 (.w1(inst33_q), .w2(DATO_IN), .igual(IGUAL_D9));  // open: menor
  comparador inst103 (.w1(inst34_q), .w2(DATO_IN), .igual(IGUAL_D10));  // open: menor
  OR_10 inst91 (
    .a(inst35_igual), .b(inst36_igual), .c(inst37_igual), .d(inst38_igual), .e(inst39_igual),
    .f(inst40_igual), .g(inst41_igual), .h(inst42_igual), .i(inst43_igual), .j(inst44_igual),
    .salida(REPETIDA));
endmodule
